# EAGLE design eprom_prog (EAGLE 7.5.0)

## Sheet 1 of 2
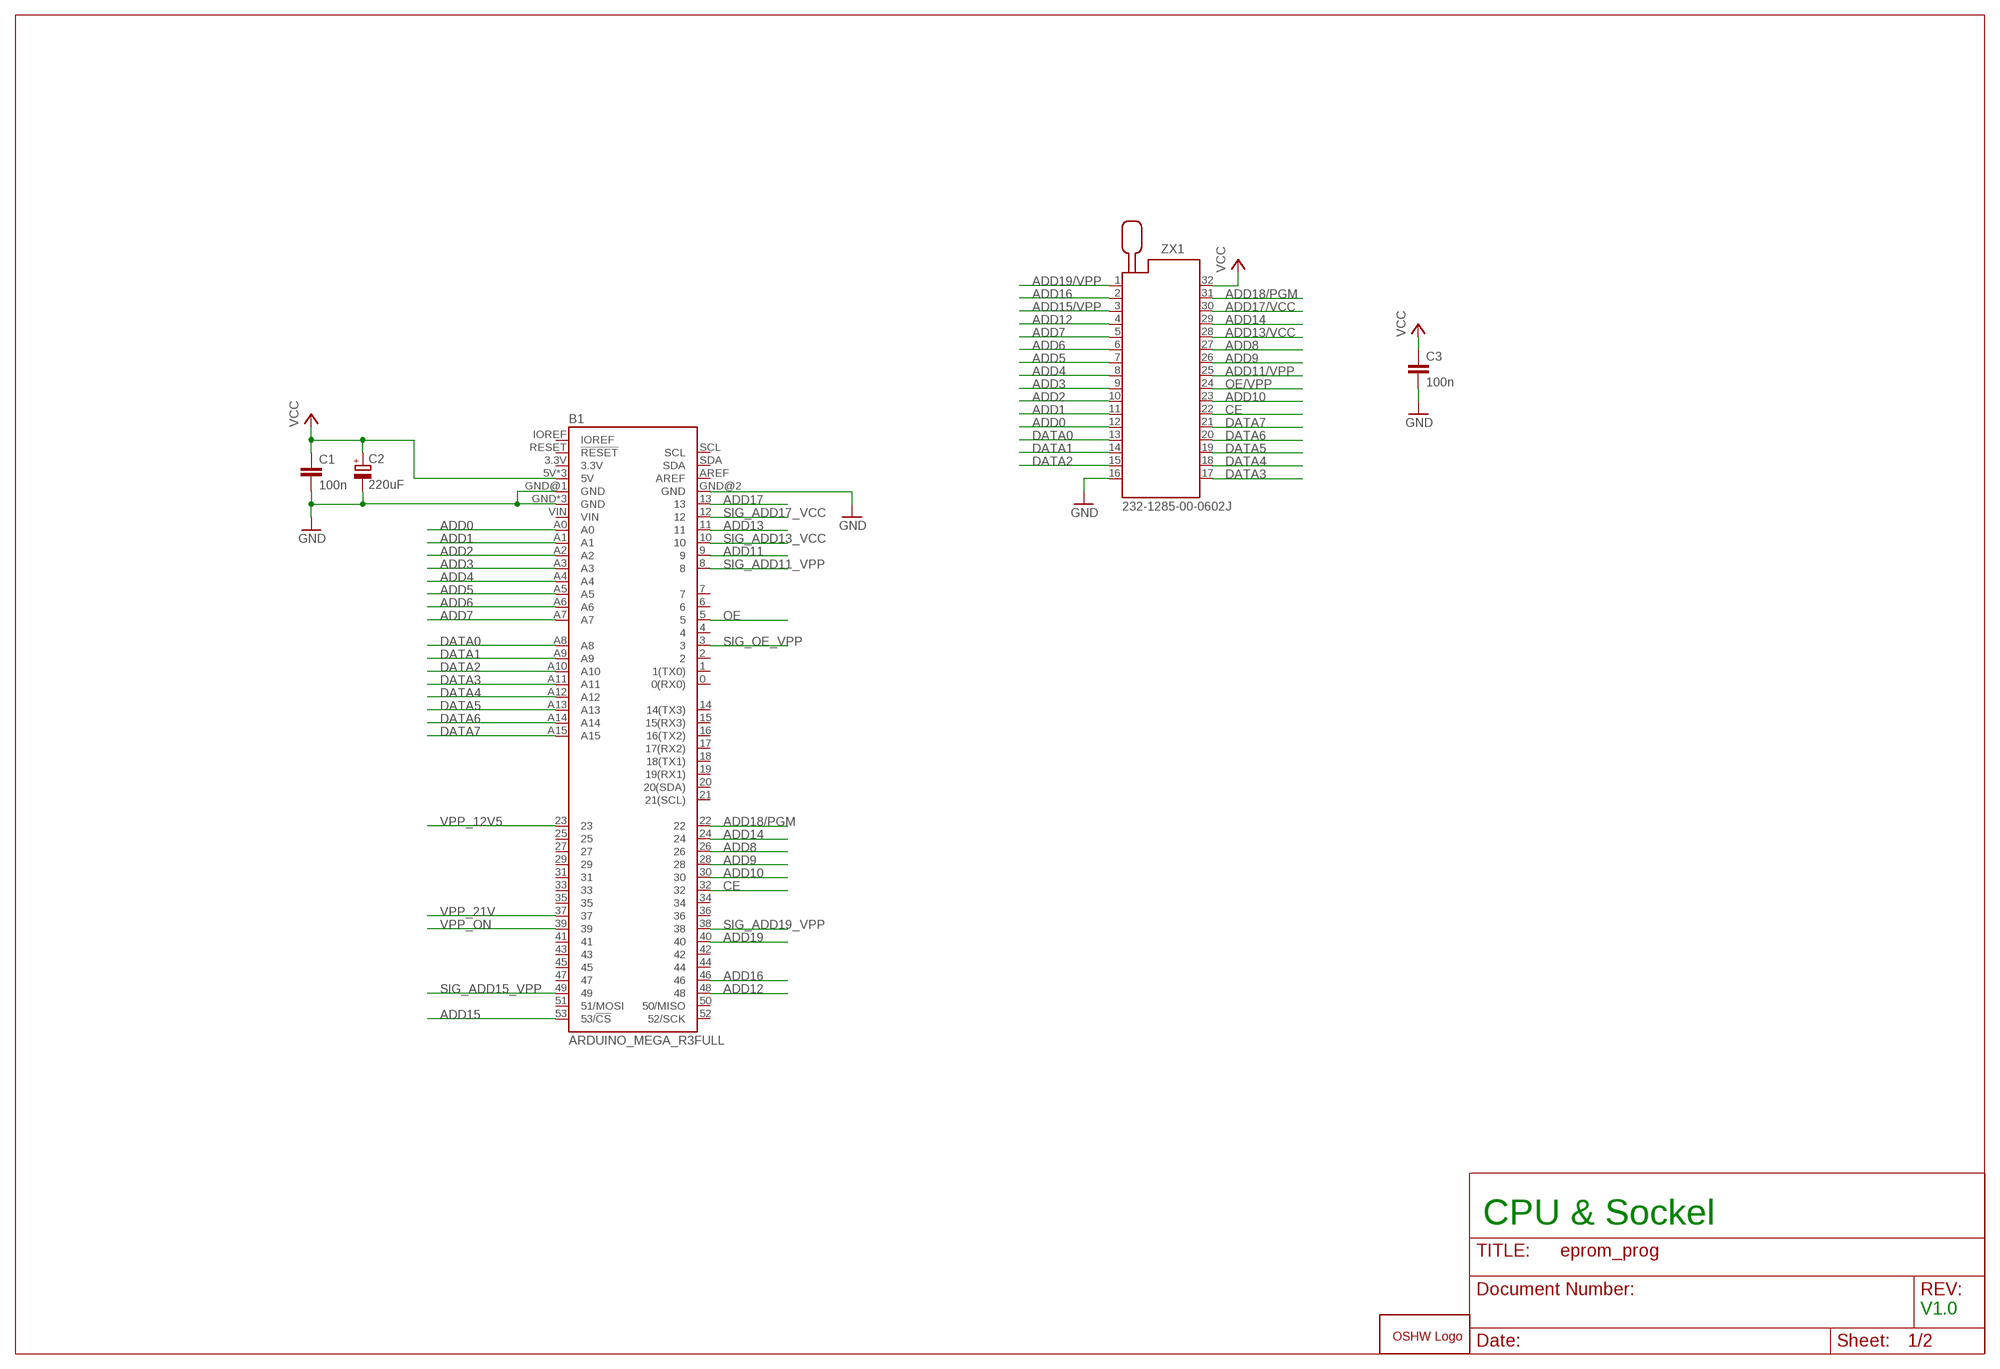
[diagram p0: schematic, sheet 1]

### Parts
B1  ARDUINO_MEGA_R3FULL  [ARDUINO_MEGA_NO_SILK]
C1  100n  C-EU050-024X044  [C050-024X044]
C2  220uF  CPOL-EUE2.5-6  [E2,5-6]
C3  100n  C-EU050-024X044  [C050-024X044]
GOLD_ORB_SM1  OSHWLOGOLOGO8MM  [OSHW_8MM]
ZX1  232-1285-00-0602J  [232-1285-00-0602J]

### Nets
ADD0: B1.A0 ZX1.12
ADD1: B1.A1 ZX1.11
ADD2: B1.A2 ZX1.10
ADD3: B1.A3 ZX1.9
ADD4: B1.A4 ZX1.8
ADD5: B1.A5 ZX1.7
ADD6: B1.A6 ZX1.6
ADD7: B1.A7 ZX1.5
ADD8: B1.26 ZX1.27
ADD9: B1.28 ZX1.26
ADD10: B1.30 ZX1.23
ADD11: B1.9 ; also sheet 2
ADD11/VPP: ZX1.25 ; also sheet 2
ADD12: B1.48 ZX1.4
ADD13: B1.11 ; also sheet 2
ADD13/VCC: ZX1.28 ; also sheet 2
ADD14: B1.24 ZX1.29
ADD15: B1.53(53/!CS) ; also sheet 2
ADD15/VPP: ZX1.3 ; also sheet 2
ADD16: B1.46 ZX1.2
ADD17: B1.13 ; also sheet 2
ADD17/VCC: ZX1.30 ; also sheet 2
ADD18/PGM: B1.22 ZX1.31
ADD19: B1.40 ; also sheet 2
ADD19/VPP: ZX1.1 ; also sheet 2
CE: B1.32 ZX1.22
DATA0: B1.A8 ZX1.13
DATA1: B1.A9 ZX1.14
DATA2: B1.A10 ZX1.15
DATA3: B1.A11 ZX1.17
DATA4: B1.A12 ZX1.18
DATA5: B1.A13 ZX1.19
DATA6: B1.A14 ZX1.20
DATA7: B1.A15 ZX1.21
GND: B1.GND B1.GND@1(GND) B1.GND@2(GND) B1.GND@3(GND) B1.GND@4(GND) C1.2 C2.- C3.2 ZX1.16 ; also sheet 2
OE: B1.5 ; also sheet 2
OE/VPP: ZX1.24 ; also sheet 2
SIG_ADD11_VPP: B1.8 ; also sheet 2
SIG_ADD13_VCC: B1.10 ; also sheet 2
SIG_ADD15_VPP: B1.49 ; also sheet 2
SIG_ADD17_VCC: B1.12 ; also sheet 2
SIG_ADD19_VPP: B1.38 ; also sheet 2
SIG_OE_VPP: B1.3 ; also sheet 2
VCC: B1.5V B1.5V@1(5V) B1.5V@2(5V) C1.1 C2.+ C3.1 ZX1.32 ; also sheet 2
VPP_12V5: B1.23 ; also sheet 2
VPP_21V: B1.37 ; also sheet 2
VPP_ON: B1.39 ; also sheet 2
Unconnected: B1.0(0(RX0)) B1.1(1(TX0)) B1.2 B1.3.3V B1.4 B1.6 B1.7 B1.14(14(TX3)) B1.15(15(RX3)) B1.16(16(TX2)) B1.17(17(RX2)) B1.18(18(TX1)) B1.19(19(RX1)) B1.20(20(SDA)) B1.21(21(SCL)) B1.25 B1.27 B1.29 B1.31 B1.33 B1.34 B1.35 B1.36 B1.41 B1.42 B1.43 B1.44 B1.45 B1.47 B1.50(50/MISO) B1.51(51/MOSI) B1.52(52/SCK) B1.AREF B1.IOREF B1.RESET(!RESET) B1.SCL B1.SDA B1.VIN

### Notes on the sheet
- CPU & Sockel
- V1.0

## Sheet 2 of 2
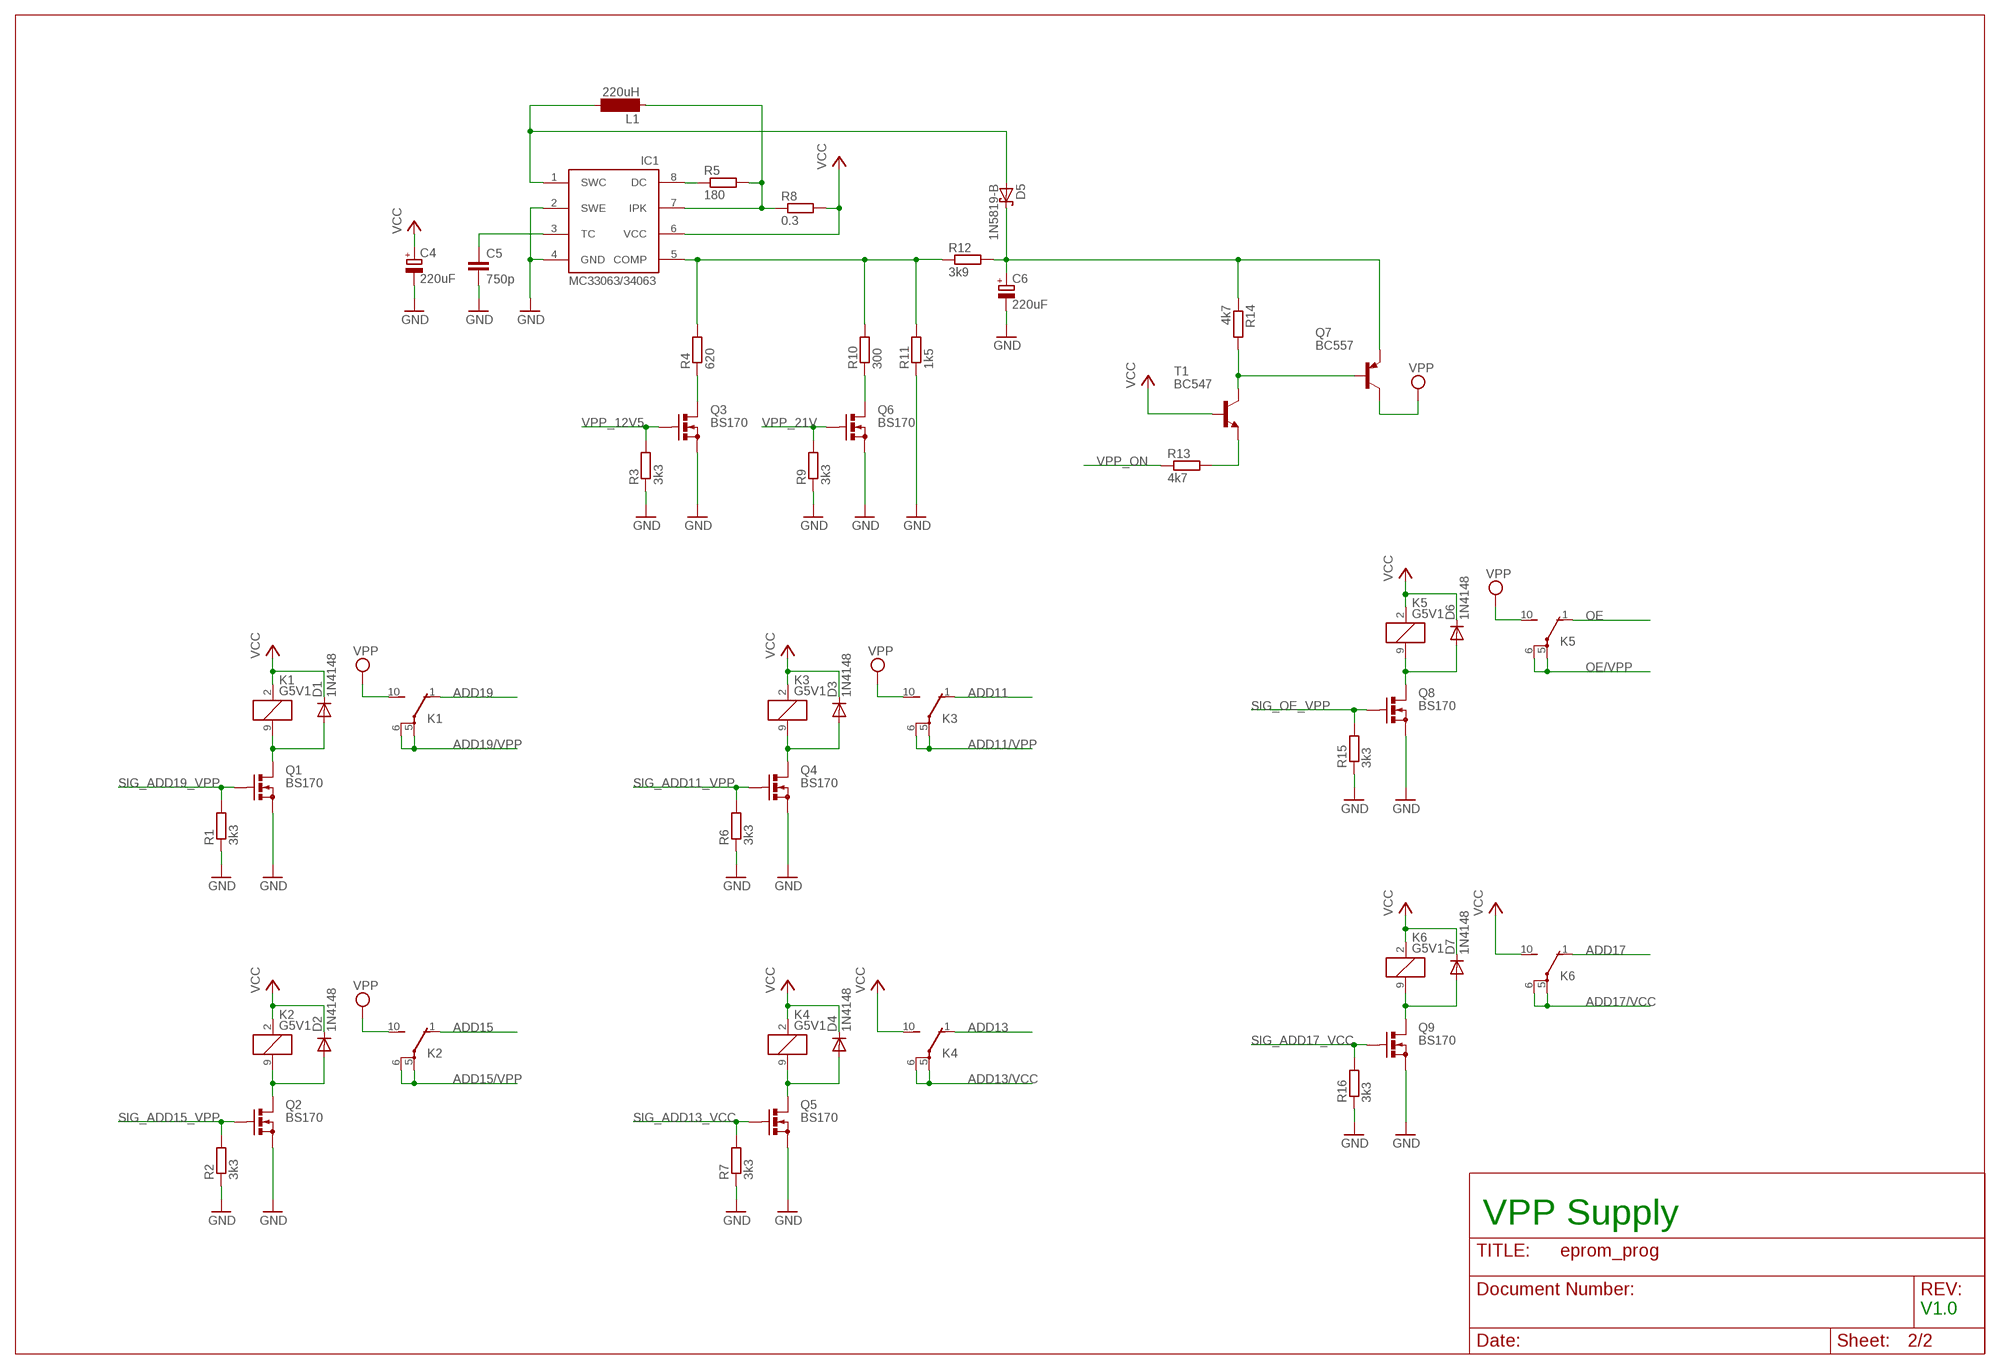
[diagram p1: schematic, sheet 2]

### Parts
C4  220uF  CPOL-EUE2.5-6  [E2,5-6]
C5  750p  C-EU050-024X044  [C050-024X044]
C6  220uF  CPOL-EUE2.5-6  [E2,5-6]
D1  1N4148  1N4148DO35-7  [DO35-7]
D2  1N4148  1N4148DO35-7  [DO35-7]
D3  1N4148  1N4148DO35-7  [DO35-7]
D4  1N4148  1N4148DO35-7  [DO35-7]
D5  1N5819-B  [DO41-7.6]
D6  1N4148  1N4148DO35-7  [DO35-7]
D7  1N4148  1N4148DO35-7  [DO35-7]
IC1  MC33063/MC34063P  [DIL08]
K1  G5V1  [G5V1]
K2  G5V1  [G5V1]
K3  G5V1  [G5V1]
K4  G5V1  [G5V1]
K5  G5V1  [G5V1]
K6  G5V1  [G5V1]
L1  220uH  SD12-1000  [SD12_1000]
Q1  BS170  [SOT54E]
Q2  BS170  [SOT54E]
Q3  BS170  [SOT54E]
Q4  BS170  [SOT54E]
Q5  BS170  [SOT54E]
Q6  BS170  [SOT54E]
Q7  BC557  [TO92]
Q8  BS170  [SOT54E]
Q9  BS170  [SOT54E]
R1  3k3  R-EU_0207/2V  [0207/2V]
R2  3k3  R-EU_0207/2V  [0207/2V]
R3  3k3  R-EU_0207/2V  [0207/2V]
R4  620  R-EU_0207/2V  [0207/2V]
R5  180  R-EU_0207/2V  [0207/2V]
R6  3k3  R-EU_0207/2V  [0207/2V]
R7  3k3  R-EU_0207/2V  [0207/2V]
R8  0.3  R-EU_0207/2V  [0207/2V]
R9  3k3  R-EU_0207/2V  [0207/2V]
R10  300  R-EU_0207/2V  [0207/2V]
R11  1k5  R-EU_0207/2V  [0207/2V]
R12  3k9  R-EU_0207/2V  [0207/2V]
R13  4k7  R-EU_0207/2V  [0207/2V]
R14  4k7  R-EU_0207/2V  [0207/2V]
R15  3k3  R-EU_0207/2V  [0207/2V]
R16  3k3  R-EU_0207/2V  [0207/2V]
T1  BC547  [TO92]

### Nets
+VPP [VPP]: C6.+ D5.C Q7.1(E) R12.2 R14.1
ADD11: K3.1(2:O) ; also sheet 1
ADD11/VPP: K3.5(2:P) K3.6(2:P) ; also sheet 1
ADD13: K4.1(2:O) ; also sheet 1
ADD13/VCC: K4.5(2:P) K4.6(2:P) ; also sheet 1
ADD15: K2.1(2:O) ; also sheet 1
ADD15/VPP: K2.5(2:P) K2.6(2:P) ; also sheet 1
ADD17: K6.1(2:O) ; also sheet 1
ADD17/VCC: K6.5(2:P) K6.6(2:P) ; also sheet 1
ADD19: K1.1(2:O) ; also sheet 1
ADD19/VPP: K1.5(2:P) K1.6(2:P) ; also sheet 1
GND: C4.- C5.2 C6.- IC1.2(SWE) IC1.4(GND) Q1.S Q2.S Q3.S Q4.S Q5.S Q6.S Q8.S Q9.S R1.1 R2.1 R3.1 R6.1 R7.1 R9.1 R11.1 R15.1 R16.1 ; also sheet 1
N$1: D2.A K2.9 Q2.D
N$2: IC1.7(IPK) L1.1 R5.2 R8.1
N$3: Q6.D R10.1
N$4: Q7.2(B) R14.2 T1.3(C)
N$5: R13.2 T1.1(E)
N$6: Q3.D R4.1
N$7: C5.1 IC1.3(TC)
N$8 [VPP]: IC1.5(COMP) R4.2 R10.2 R11.2 R12.1
N$9: IC1.8(DC) R5.1
N$11: D5.A IC1.1(SWC) L1.2
N$13: D1.A K1.9 Q1.D
N$14: D3.A K3.9 Q4.D
N$15: D4.A K4.9 Q5.D
N$16: D6.A K5.9 Q8.D
N$17: D7.A K6.9 Q9.D
OE: K5.1(2:O) ; also sheet 1
OE/VPP: K5.5(2:P) K5.6(2:P) ; also sheet 1
SIG_ADD11_VPP: Q4.G R6.2 ; also sheet 1
SIG_ADD13_VCC: Q5.G R7.2 ; also sheet 1
SIG_ADD15_VPP: Q2.G R2.2 ; also sheet 1
SIG_ADD17_VCC: Q9.G R16.2 ; also sheet 1
SIG_ADD19_VPP: Q1.G R1.2 ; also sheet 1
SIG_OE_VPP: Q8.G R15.2 ; also sheet 1
VCC: C4.+ D1.C D2.C D3.C D4.C D6.C D7.C IC1.6(VCC) K1.2 K2.2 K3.2 K4.2 K4.10(2:S) K5.2 K6.2 K6.10(2:S) R8.2 T1.2(B) ; also sheet 1
VPP [VPP]: K1.10(2:S) K2.10(2:S) K3.10(2:S) K5.10(2:S) Q7.3(C)
VPP_12V5: Q3.G R3.2 ; also sheet 1
VPP_21V: Q6.G R9.2 ; also sheet 1
VPP_ON: R13.1 ; also sheet 1

### Notes on the sheet
- VPP Supply
- V1.0

## Library data of the parts
B1 = SparkFun-Boards:ARDUINO_MEGA_R3: Arduino Mega R3 ATmega2560 R3 compatible footprint. SparkFun Products: Arduino Mega 2560 R3 <https://www.sparkfun.com/products/11061>
C1 C3 C5 = rcl:C-EU: CAPACITOR, European symbol
C2 C4 C6 = rcl:CPOL-EU: POLARIZED CAPACITOR, European symbol
D1-D4 D6 D7 = diode:1N4148: DIODE high speed (Philips)
D5 = diode:1N581*: 1.0A SCHOTTKY BARRIER RECTIFIER Source: http://www.diodes.com/datasheets/ds23001.pdf
GOLD_ORB_SM1 = oshw:OSHWLOGO: The OSHW logo for PCB layout
IC1 = adafruit:MC33063/MC34063: MC33063 and MC34063 Basic DC/DC converter with internal power-NPN transistor, 100KHz, 1.5A peak switch current. 3-40 input/output.
K1-K6 = relay:G5V1: RELAY 1 x switch, 0.5 A/125 V AC, 1 A/24 V DC , Omron; MPN: G5V-1-DC24; OC_FARNELL: 9949593; OC_NEWARK: 36M6377
L1 = inductor-neosid:SD12: INDUCTOR nominal inductance; OC_FARNELL: unknown; OC_NEWARK: unknown
Q1-Q6 Q8 Q9 = transistor-small-signal:BS170: N-CHANNEL MOS FET
Q7 = transistor-pnp:BC557: PNP Transistor
R1-R16 = rcl:R-EU_: RESISTOR, European symbol
T1 = transistor:BC547: NPN TRANSISTOR
ZX1 = con-3m:232-?: Zero Insertion Force Socked Source: http://www.3M.com/ehpd; MF: 3M; MPN: 232-1285-00-0602J; OC_FARNELL: 9897402; OC_NEWARK: 85K7839

## Net classes
0 default: width 0.406 mm
1 VPP: width 0.61 mm

## Board
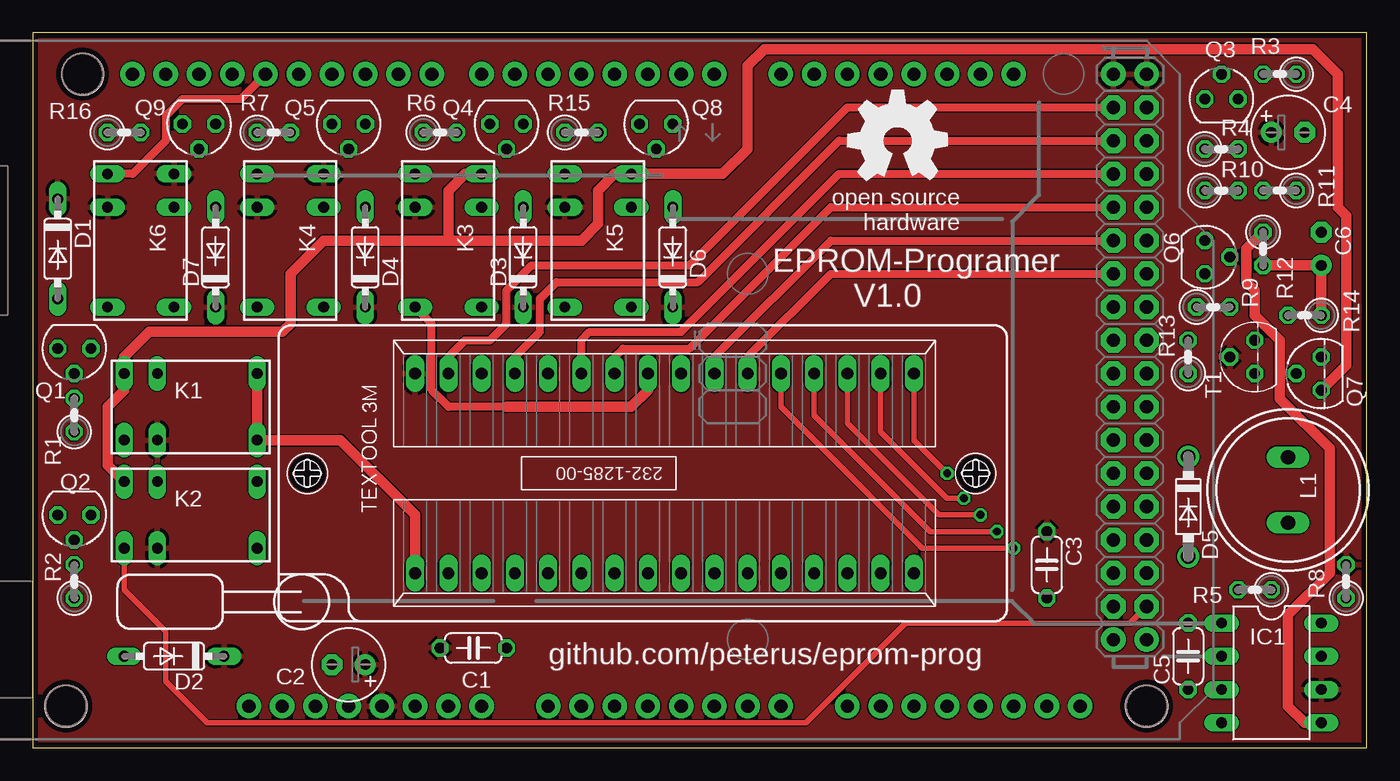
[diagram p2: board, top side]
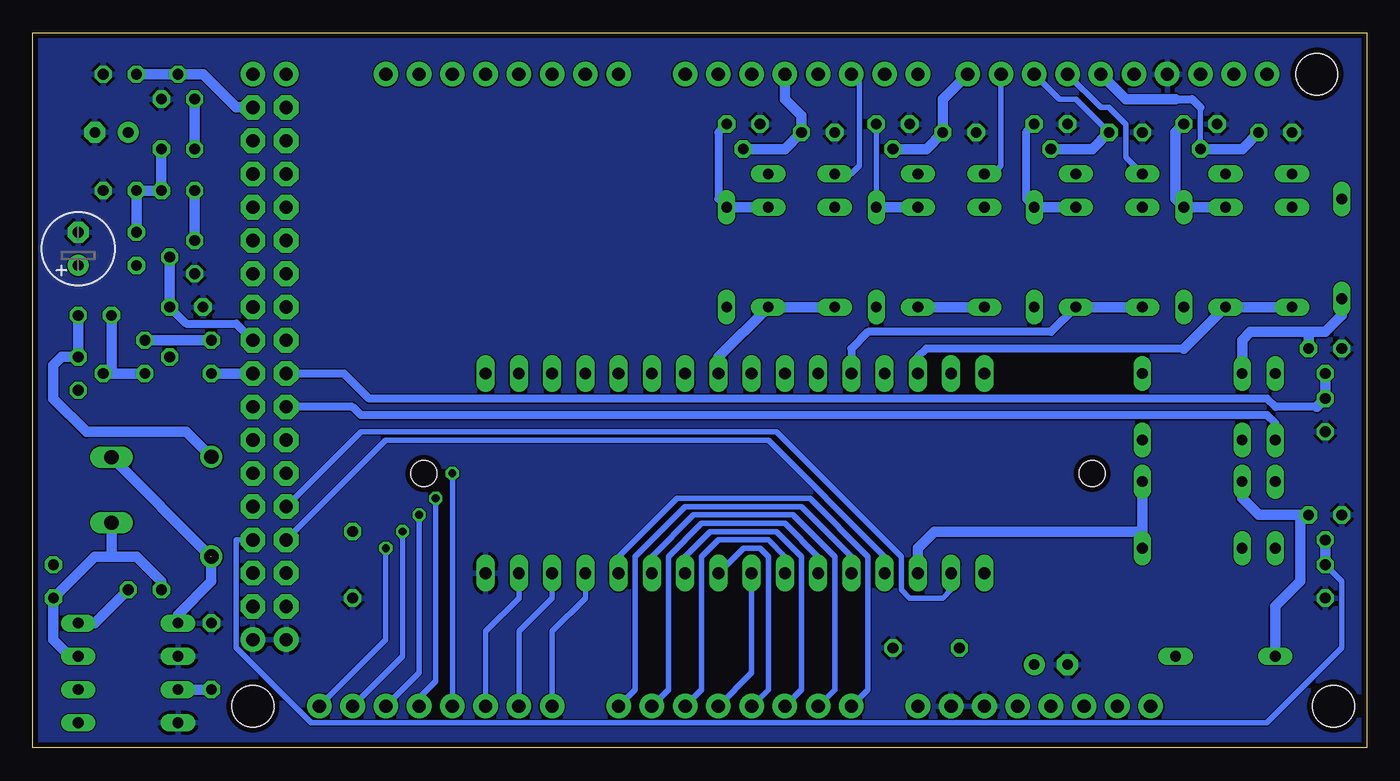
[diagram p3: board, bottom side, seen from below]

Size 101.91 x 54.6 mm. Coordinates in mm from the lower left corner, seen from the top.
Outline: 0,0 101.91,0 101.91,54.6 0,54.6 0,0
Copper layers (1*16): Top 0.035mm / dielectric 1.5mm / Bottom 0.035mm
Design rules "jlcpcb": minimum track width 3.5mil, minimum drill 0.2mm, track to track 3.5mil, track to pad 5mil, pad to pad 5mil, via to via 5mil, smd to smd 5mil, copper to edge 0.4mm, drill to drill 8mil, minimum pad ring 10mil, minimum via ring 8mil, stop-mask expansion 4mil, vias tented up to drill 0mil, thermal gap 10mil
Holes 3.2 mm at 2.54,3.17 85.09,3.17 3.81,51.44

### Footprints (pad centres in the part's own frame; a part is rotated, then mirrored left to right if it is on the bottom)
ARDUINO_MEGA_NO_SILK = drill 1.016 pad 1.88: 0 13.97,24.13; 1 11.43,24.13; 2 8.89,24.13; 3 6.35,24.13; 3.3V -13.97,-24.13; 4 3.81,24.13; 5 1.27,24.13; 5V -11.43,-24.13; 5V@1 44.45,24.13; 5V@2 46.99,24.13; 6 -1.27,24.13; 7 -3.81,24.13; 8 -7.62,24.13; 9 -10.16,24.13; 10 -12.7,24.13; 11 -15.24,24.13; 12 -17.78,24.13; 13 -20.32,24.13; 14 19.05,24.13; 15 21.59,24.13; 16 24.13,24.13; 17 26.67,24.13; 18 29.21,24.13; 19 31.75,24.13; 20 34.29,24.13; 21 36.83,24.13; A0 1.27,-24.13; A1 3.81,-24.13; A2 6.35,-24.13; A3 8.89,-24.13; A4 11.43,-24.13; A5 13.97,-24.13; A6 16.51,-24.13; A7 19.05,-24.13; A8 24.13,-24.13; A9 26.67,-24.13; A10 29.21,-24.13; A11 31.75,-24.13; A12 34.29,-24.13; A13 36.83,-24.13; A14 39.37,-24.13; A15 41.91,-24.13; AREF -25.4,24.13; GND -8.89,-24.13; GND@1 -6.35,-24.13; GND@2 44.45,-19.05; GND@3 46.99,-19.05; GND@4 -22.86,24.13; IOREF -19.05,-24.13; NC -21.59,-24.13; RESET -16.51,-24.13; SCL -30.48,24.13; SDA -27.94,24.13; VIN -3.81,-24.13 | drill 1.016 pad 1.88 octagon: 22 44.45,21.59; 23 46.99,21.59; 24 44.45,19.05; 25 46.99,19.05; 26 44.45,16.51; 27 46.99,16.51; 28 44.45,13.97; 29 46.99,13.97; 30 44.45,11.43; 31 46.99,11.43; 32 44.45,8.89; 33 46.99,8.89; 34 44.45,6.35; 35 46.99,6.35; 36 44.45,3.81; 37 46.99,3.81; 38 44.45,1.27; 39 46.99,1.27; 40 44.45,-1.27; 41 46.99,-1.27; 42 44.45,-3.81; 43 46.99,-3.81; 44 44.45,-6.35; 45 46.99,-6.35; 46 44.45,-8.89; 47 46.99,-8.89; 48 44.45,-11.43; 49 46.99,-11.43; 50 44.45,-13.97; 51 46.99,-13.97; 52 44.45,-16.51; 53 46.99,-16.51
C050-024X044 = drill 0.813 octagon: 1 -2.54,0; 2 2.54,0
E2,5-6 = drill 0.813 pad 1.6: + -1.27,0 | drill 0.813 pad 1.6 octagon: - 1.27,0
DO35-7 = drill 0.813 long: A 3.81,0; C -3.81,0
DO41-7.6 = drill 1.1 pad 1.7: A 3.81,0; C -3.81,0
DIL08 = drill 0.813 long: 1 -3.81,-3.81; 2 -1.27,-3.81; 3 1.27,-3.81; 4 3.81,-3.81; 5 3.81,3.81; 6 1.27,3.81; 7 -1.27,3.81; 8 -3.81,3.81
G5V1 = drill 0.813 long: 1 -5.08,-2.54; 2 -2.54,-2.54; 5 5.08,-2.54; 6 5.08,2.54; 9 -2.54,2.54; 10 -5.08,2.54
SD12_1000 = drill 1.1 long: 1 -2.5,0; 2 2.5,0
SOT54E = drill 0.813 octagon: D -1.27,0; G 0,1.905; S 1.27,0
TO92 = drill 0.813 octagon: 1 1.27,0; 2 0,1.905; 3 -1.27,0
0207/2V = drill 0.813 octagon: 1 -1.27,0; 2 1.27,0
232-1285-00-0602J = drill 0.9 long: 1 -19.05,-7.62; 2 -16.51,-7.62; 3 -13.97,-7.62; 4 -11.43,-7.62; 5 -8.89,-7.62; 6 -6.35,-7.62; 7 -3.81,-7.62; 8 -1.27,-7.62; 9 1.27,-7.62; 10 3.81,-7.62; 11 6.35,-7.62; 12 8.89,-7.62; 13 11.43,-7.62; 14 13.97,-7.62; 15 16.51,-7.62; 16 19.05,-7.62; 17 19.05,7.62; 18 16.51,7.62; 19 13.97,7.62; 20 11.43,7.62; 21 8.89,7.62; 22 6.35,7.62; 23 3.81,7.62; 24 1.27,7.62; 25 -1.27,7.62; 26 -3.81,7.62; 27 -6.35,7.62; 28 -8.89,7.62; 29 -11.43,7.62; 30 -13.97,7.62; 31 -16.51,7.62; 32 -19.05,7.62 | hole 2: 23.78,0; -27.28,0

### Placement (x,y rotation side)
B1  38.1,27.3 0 top
C1  33.66,7.62 0 top
C2  24.13,6.35 180 top
C3  77.47,13.97 270 top
C4  95.89,46.99 0 top
C5  88.27,6.99 90 top
C6  98.42,38.1 90 bottom
D1  1.91,38.1 270 top
D2  10.79,6.99 180 top
D3  37.47,37.47 90 top
D4  25.4,37.47 90 top
D5  88.27,18.41 270 top
D6  48.9,37.47 90 top
D7  13.97,37.47 90 top
GOLD_ORB_SM1  66.04,46.35 0 top
IC1  94.61,5.71 270 top
K1  12.06,26.04 0 top
K2  12.06,17.78 0 top
K3  31.75,38.73 270 top
K4  19.68,38.73 270 top
K5  43.18,38.73 270 top
K6  8.26,38.73 270 top
L1  95.89,19.68 90 top
Q1  3.17,30.48 180 top
Q2  3.17,17.78 180 top
Q3  90.81,49.53 0 top
Q4  36.2,47.62 180 top
Q5  24.13,47.62 180 top
Q6  89.53,37.47 270 top
Q7  98.42,28.57 90 top
Q8  47.62,47.62 180 top
Q9  12.7,47.62 180 top
R1  3.17,25.4 90 top
R2  3.17,12.7 90 top
R3  95.25,51.44 180 top
R4  90.81,45.72 0 top
R5  93.34,12.06 180 top
R6  31.11,46.99 0 top
R7  18.41,46.99 0 top
R8  100.33,12.7 90 top
R9  90.17,33.66 0 top
R10  90.81,42.55 0 top
R11  95.25,42.55 180 top
R12  93.98,38.1 270 top
R13  88.27,29.84 90 top
R14  97.16,33.02 180 top
R15  41.91,46.99 0 top
R16  6.99,46.99 0 top
T1  93.34,29.84 90 top
ZX1  48.26,20.95 0 top

### Tracks (layer width: path | path; a pad name or v marks a point on that pad's centre or on a via)
+VPP
  Top 0.813: R14.1 C6.+ R12.2
  Bottom 0.813: R14.1 Q7.1 99.69,29.84 100.33,29.21 100.33,26.67 97.79,24.13 90.17,24.13 D5.C
ADD0
  Bottom 0.406: ZX1.12 57.15,14.61 52.7,19.05 42.55,19.05 38.1,14.61 38.1,4.45 B1.A0
ADD1
  Bottom 0.406: ZX1.11 54.61,14.61 51.44,17.78 43.81,17.78 40.64,14.61 40.64,4.45 B1.A1
ADD2
  Bottom 0.406: ZX1.10 52.07,14.61 50.16,16.51 45.09,16.51 43.18,14.61 43.18,4.45 B1.A2
ADD3
  Bottom 0.406: ZX1.9 47.62,15.24 46.35,15.24 45.72,14.61 45.72,4.45 B1.A3
ADD4
  Bottom 0.406: ZX1.8 46.99,5.71 B1.A4
ADD5
  Bottom 0.406: ZX1.7 44.45,14.61 45.72,15.88 49.53,15.88 50.8,14.61 50.8,4.45 B1.A5
ADD6
  Bottom 0.406: ZX1.6 41.91,14.61 44.45,17.14 50.8,17.14 53.34,14.61 53.34,4.45 B1.A6
ADD7
  Bottom 0.406: ZX1.5 39.37,14.61 43.18,18.41 52.07,18.41 55.88,14.61 55.88,4.45 B1.A7
ADD8
  Top 0.61: ZX1.27 41.91,31.11 42.55,31.75 49.53,31.75 61.59,43.81 B1.26
ADD9
  Top 0.61: ZX1.26 44.45,29.84 45.09,30.48 50.16,30.48 60.96,41.27 B1.28
ADD10
  Top 0.61: ZX1.23 52.07,29.84 60.96,38.73 B1.30
ADD11
  Bottom 0.406: B1.9 27.94,44.45 28.57,43.81 K3.1
ADD11/VPP
  Top 0.61: 36.2,26.04 31.75,26.04 30.48,27.3 30.48,32.38 K3.5
  Top 0.813: ZX1.25 46.99,27.3 45.72,26.04 36.2,26.04
  Bottom 0.813: K3.6 K3.5
ADD12
  Bottom 0.406: ZX1.4 36.83,14.61 45.72,23.5 74.93,23.5 B1.48
ADD13
  Bottom 0.406: B1.11 20.32,48.9 19.68,48.9 18.41,47.62 18.41,45.09 K4.1
ADD13/VCC
  Bottom 0.61: K4.6 24.13,31.75 38.1,31.75 39.37,30.48 ZX1.28
  Bottom 0.813: K4.6 K4.5
ADD14
  Top 0.61: ZX1.29 36.83,29.84 38.73,31.75 38.73,34.29 40.01,35.56 50.8,35.56 61.59,46.35 B1.24
ADD15
  Top 0.406: B1.53 83.82,9.53 66.67,9.53 59.05,1.91 13.34,1.91 10.16,5.08 10.16,8.89 6.99,12.06 K2.1
ADD15/VPP
  Bottom 0.813: K2.5 17.14,16.51 | 17.14,16.51 K2.6 | ZX1.3 34.29,15.24 33.02,16.51 17.14,16.51
ADD16
  Bottom 0.406: B1.46 76.83,24.13 45.09,24.13 35.56,14.61 35.56,12.06 34.92,11.43 32.38,11.43 31.75,12.06 ZX1.2
ADD17
  Top 0.61: B1.13 15.88,49.53 11.43,49.53 10.16,48.26 10.16,46.35 7.62,43.81 K6.1
ADD17/VCC
  Bottom 0.61: 13.97,30.48 33.66,30.48 34.29,29.84 ZX1.30
  Bottom 0.813: 13.97,30.48 K6.6 K6.5
ADD18/PGM
  Top 0.61: ZX1.31 31.75,29.84 33.02,31.11 34.92,31.11 36.2,32.38 36.2,34.92 38.1,36.83 50.16,36.83 62.23,48.9 B1.22
ADD19
  Bottom 0.61: K1.1 6.99,24.77 7.62,25.4 76.83,25.4 77.47,26.04 B1.40
ADD19/VPP
  Top 0.813: K1.6 K1.5 23.5,23.5 29.21,17.78 ZX1.1
CE
  Top 0.61: ZX1.22 54.61,29.84 60.96,36.2 B1.32
DATA0
  Bottom 0.406: B1.A8 62.23,8.89 59.69,11.43 ZX1.13
DATA1
  Bottom 0.406: B1.A9 64.77,8.89 62.23,11.43 ZX1.14
DATA2
  Bottom 0.406: B1.A10 67.31,8.89 64.77,11.43 ZX1.15
DATA3  (via drill 0.6)
  Top 0.406: v69.85,20.95 67.31,23.5 ZX1.17
  Bottom 0.406: B1.A11 v69.85,20.95
DATA4  (via drill 0.6)
  Top 0.406: v71.12,19.05 69.85,19.05 64.77,24.13 ZX1.18
  Bottom 0.406: B1.A12 72.39,3.81 71.12,5.08 v71.12,19.05
DATA5  (via drill 0.6)
  Top 0.406: v72.39,17.78 69.22,17.78 62.23,24.77 ZX1.19
  Bottom 0.406: B1.A13 72.39,5.71 v72.39,17.78
DATA6  (via drill 0.6)
  Top 0.406: v73.66,16.51 68.58,16.51 59.69,25.4 ZX1.20
  Bottom 0.406: B1.A14 73.66,6.99 v73.66,16.51
DATA7  (via drill 0.6)
  Top 0.406: v74.93,15.24 67.94,15.24 57.15,26.04 ZX1.21
  Bottom 0.406: B1.A15 74.93,8.26 v74.93,15.24
GND
  pour Bottom: 0,0 102.23,0 102.23,54.61 0,54.61
N$1
  Bottom 0.813: K2.9 9.53,19.05 8.26,17.78 5.08,17.78 | 5.08,17.78 Q2.D | D2.A 6.99,10.79 5.08,12.7 5.08,17.78
N$2
  Bottom 0.813: IC1.7 99.06,6.99 100.33,8.26 R8.1 97.16,14.61 95.89,14.61 | R5.2 92.08,12.7 93.98,14.61 95.89,14.61 | 95.89,14.61 L1.1
N$3
  Bottom 0.813: Q6.D R10.1
N$4
  Bottom 0.813: T1.3 95.89,28.57 | 95.89,28.57 Q7.2 | R14.2 95.89,28.57
N$5
  Bottom 0.813: R13.2 T1.1
N$6
  Bottom 0.813: Q3.D R4.1
N$7
  Bottom 0.813: IC1.3 C5.1
N$8
  Top 0.813: R12.1 92.71,38.1 92.71,35.56 93.34,34.92 93.34,33.02 95.25,31.11 95.25,26.67 99.06,22.86 99.06,13.34 95.89,10.16 95.89,3.17 97.16,1.91 IC1.5
  Bottom 0.813: R12.1 R11.2 R10.2 R4.2
N$9
  Bottom 0.813: IC1.8 97.16,9.53 R5.1
N$11  (1 unrouted)
  Bottom 0.813: IC1.1 90.81,10.16 88.27,12.7 D5.A | 88.31,14.61 L1.2
N$13
  Bottom 0.813: K1.9 9.53,31.11 8.89,31.75 4.45,31.75 | 4.45,31.75 3.17,31.75 1.91,33.02 D1.A | Q1.D 4.45,31.75
N$14
  Bottom 0.406: Q4.D D3.A
  Bottom 0.813: K3.9 D3.A
N$15
  Bottom 0.61: Q5.D 26.04,46.99 26.04,41.91 D4.A
  Bottom 0.813: K4.9 D4.A
N$16
  Bottom 0.61: Q8.D 49.53,46.99 49.53,41.91 D6.A
  Bottom 0.813: K5.9 D6.A
N$17
  Bottom 0.813: K6.9 D7.A 14.61,41.91 14.61,46.99 Q9.D
OE
  Bottom 0.406: K5.1 39.37,43.81 38.73,44.45 38.73,50.8 B1.5
OE/VPP
  Bottom 0.813: K5.5 K5.6 49.53,29.84 ZX1.24
SIG_ADD11_VPP
  Bottom 0.813: B1.8 32.38,49.53 R6.2 33.66,45.72 Q4.G
SIG_ADD13_VCC
  Bottom 0.406: B1.10 23.5,49.53 22.23,49.53 R7.2
  Bottom 0.813: R7.2 20.95,45.72 Q5.G
SIG_ADD15_VPP
  Bottom 0.406: B1.49 86.36,15.88 86.36,7.62 80.64,1.91 7.62,1.91 1.91,7.62 1.91,12.7 R2.2
  Bottom 0.813: Q2.G R2.2
SIG_ADD17_VCC
  Bottom 0.406: 12.7,48.9 Q9.G
  Bottom 0.61: 14.61,49.53 13.34,49.53 12.7,48.9
  Bottom 0.813: R16.2 9.53,45.72 Q9.G | B1.12 18.41,49.53 14.61,49.53
SIG_ADD19_VPP
  Bottom 0.61: 3.81,26.04 6.99,26.04 7.62,26.67 76.2,26.67 78.11,28.57 B1.38
  Bottom 0.813: Q1.G R1.2 3.81,26.04
SIG_OE_VPP
  Bottom 0.813: Q8.G 44.45,45.72 R15.2 43.18,48.26 44.45,49.53 B1.3
VCC
  pour Top: 0,0 102.23,0 102.23,54.61 0,54.61
VPP
  Top 0.813: 31.75,38.73 41.91,38.73 43.18,40.01 43.18,42.55 44.45,43.81 K5.10 52.7,43.81 54.61,45.72 54.61,52.07 55.88,53.34 97.79,53.34 99.69,51.44 99.69,41.27 100.33,40.64 100.33,29.21 Q7.3 | K3.10 33.02,43.81 31.75,42.55 31.75,38.73 | 31.75,38.73 22.23,38.73 19.68,36.2 19.68,32.38 19.05,31.75 8.89,31.75 6.99,29.84 K1.10 6.99,27.3 5.71,26.04 5.71,21.59 K2.10
VPP_12V5
  Bottom 0.813: B1.23 86.36,48.9 88.9,51.44 Q3.G R3.2
VPP_21V
  Bottom 0.61: R9.2 90.17,32.38 86.36,32.38 B1.37
  Bottom 0.813: Q6.G R9.2
VPP_ON
  Bottom 0.813: B1.39 R13.1

### Text on the board
tNames: EPROM-Programer / V1.0 | github.com/peterus/eprom-prog